# EAGLE design pumpShield (EAGLE 9.1.0)
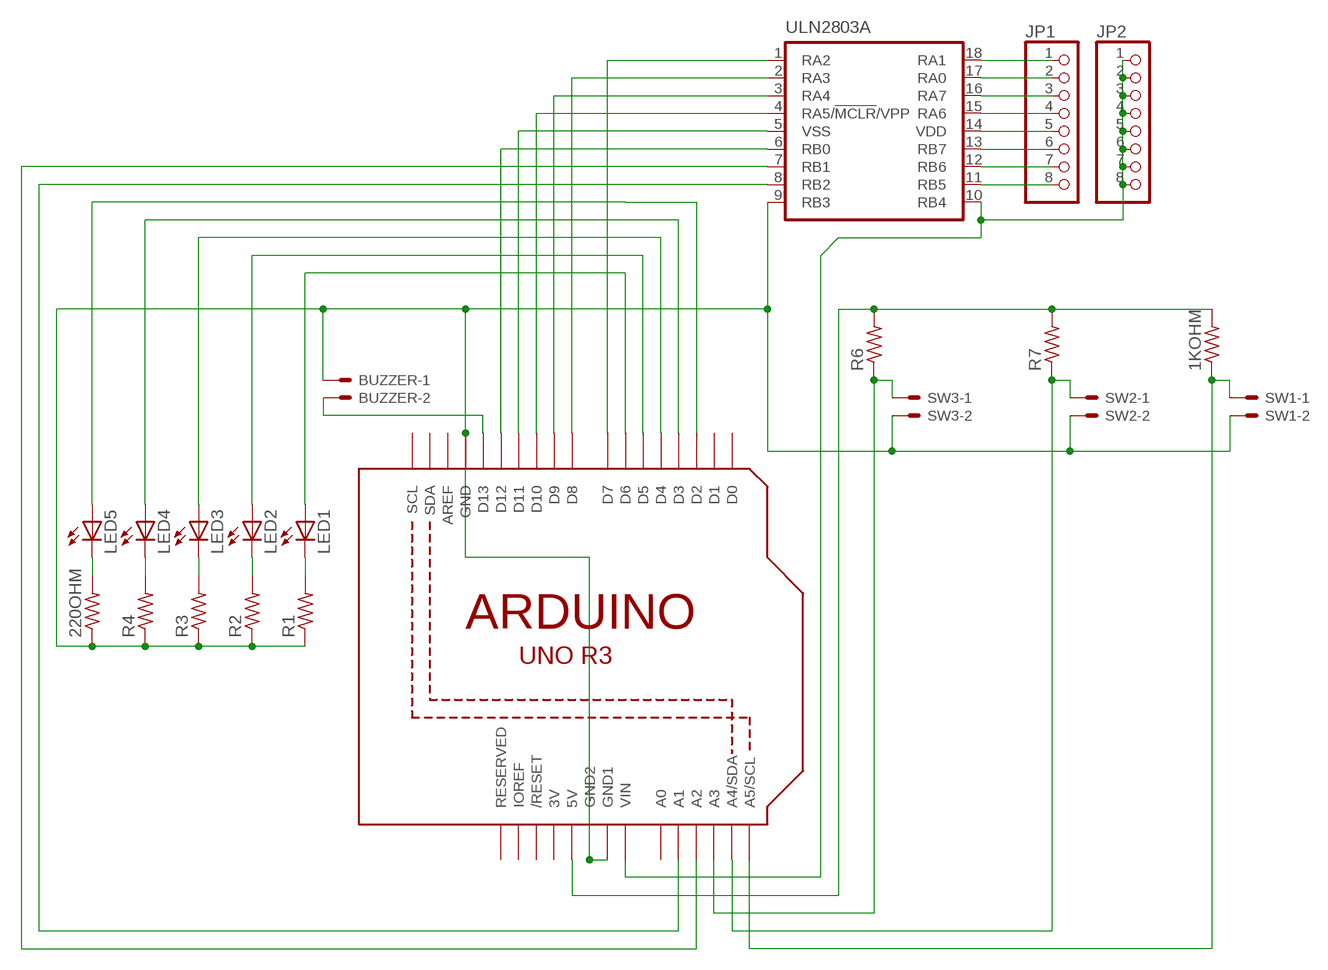
[diagram p0: schematic, sheet 1]

## Parts
1KOHM  R-US_0207/9  [0207/9]
220OHM  R-US_0207/9  [0207/9]
BUZZER  22-23-2021  [22-23-2021]
JP1  PINHD-1X8CLEANBIG  [1X08-CLEANBIG]
JP2  PINHD-1X8CLEANBIG  [1X08-CLEANBIG]
LED1  LED3MM  [LED3MM]
LED2  LED3MM  [LED3MM]
LED3  LED3MM  [LED3MM]
LED4  LED3MM  [LED3MM]
LED5  LED3MM  [LED3MM]
R1  R-US_0207/9  [0207/9]
R2  R-US_0207/9  [0207/9]
R3  R-US_0207/9  [0207/9]
R4  R-US_0207/9  [0207/9]
R6  R-US_0207/9  [0207/9]
R7  R-US_0207/9  [0207/9]
SW1  22-23-2021  [22-23-2021]
SW2  22-23-2021  [22-23-2021]
SW3  22-23-2021  [22-23-2021]
U1  ARDUINOR3-DIMENSION  [ARDUINOR3]
ULN2803A  PIC16F1826/27P  [DIL18]

## Nets
N$1: 220OHM.1 BUZZER.1 R1.1 R2.1 R3.1 R4.1 SW1.2 SW2.2 SW3.2 U1.GND U1.GND1 U1.GND2 ULN2803A.9(RB3)
N$2: JP2.1 JP2.2 JP2.3 JP2.4 JP2.5 JP2.6 JP2.7 JP2.8 U1.VIN ULN2803A.10(RB4)
N$3: LED1.A U1.D6
N$4: LED2.A U1.D5
N$5: LED3.A U1.D4
N$6: LED4.A U1.D3
N$7: U1.D7 ULN2803A.1(RA2)
N$8: U1.D8 ULN2803A.2(RA3)
N$9: U1.D9 ULN2803A.3(RA4)
N$10: U1.D10 ULN2803A.4(RA5/!MCLR!/VPP)
N$11: U1.D11 ULN2803A.5(VSS)
N$12: U1.D12 ULN2803A.6(RB0)
N$13: LED1.K(C) R1.2
N$14: LED2.K(C) R2.2
N$15: LED3.K(C) R3.2
N$16: LED4.K(C) R4.2
N$17: 220OHM.2 LED5.K(C)
N$18: LED5.A U1.D2
N$19: BUZZER.2 U1.D13
N$20: 1KOHM.2 R6.2 R7.2 U1.5V
N$21: JP1.8 ULN2803A.11(RB5)
N$22: JP1.7 ULN2803A.12(RB6)
N$23: JP1.6 ULN2803A.13(RB7)
N$24: JP1.5 ULN2803A.14(VDD)
N$25: JP1.4 ULN2803A.15(RA6)
N$26: JP1.3 ULN2803A.16(RA7)
N$27: R6.1 SW3.1 U1.A3
N$28: R7.1 SW2.1 U1.A4(A4/SDA)
N$29: 1KOHM.1 SW1.1 U1.A5(A5/SCL)
N$30: U1.A1 ULN2803A.8(RB2)
N$31: U1.A2 ULN2803A.7(RB1)
N$32: JP1.2 ULN2803A.17(RA0)
N$33: JP1.1 ULN2803A.18(RA1)
Unconnected: U1.A0 U1.AREF U1.D0 U1.D1 U1.IOREF U1.RESERVED U1.RESET(/RESET) U1.SCL U1.SDA

## Power pins joined to a net without a drawn wire
3V: U1.3V

## Library data of the parts
1KOHM 220OHM R1-R4 R6 R7 = adafruit:R-US_: RESISTOR, American symbol
BUZZER SW1-SW3 = con-molex:22-23-2021: .100" (2.54mm) Center Header - 2 Pin; MF: MOLEX; MPN: 22-23-2021; OC_FARNELL: 1462926; OC_NEWARK: 25C3832
JP1 JP2 = adafruit:PINHD-1X8: PIN HEADER
LED1-LED5 = adafruit:LED: LED OSRAM: - CHIPLED LG R971, LG N971, LY N971, LG Q971, LY Q971, LO R971, LY R971 LH N974, LH R974 LS Q976, LO Q976, LY Q976 LO Q996 - Hyper CHIPLED LW Q18S LB Q993, LB Q99A, LB R99A - SideLED LS A670, LO A670, LY A670, LG A670, LP A670 LB A673, LV A673, LT A673, LW A673 LH A674 LY A675 LS A676, LA A676, LO A676, LY A676, LW A676 LS A679, LY A679, LG A679 - Hyper Micro SIDELED® LS Y876, LA Y876, LO Y876, LY Y876 LT Y87S - SmartLED LW L88C, LW L88S LB L89C, LB L89S, LG L890 LS L89K, LO L89K, LY L89K LS L896, LA L896, LO L896, LY L896 - TOPLED LS T670, LO T670, LY T670, LG T670, LP T670 LSG T670, LSP T670, LSY T670, LOP T670, LYG T670 LG T671, LOG T671, LSG T671 LB T673, LV T673, LT T673, LW T673 LH T674 LS T676, LA T676, LO T676, LY T676, LB T676, LH T676, LSB T676, LW T676 LB T67C, LV T67C, LT T67C, LS T67K, LO T67K, LY T67K, LW E67C LS E67B, LA E67B, LO E67B, LY E67B, LB E67C, LV E67C, LT E67C LW T67C LS T679, LY T679, LG T679 LS T770, LO T770, LY T770, LG T770, LP T770 LB T773, LV T773, LT T773, LW T773 LH T774 LS E675, LA E675, LY E675, LS T675 LS T776, LA T776, LO T776, LY T776, LB T776 LHGB T686 LT T68C, LB T68C - Hyper Mini TOPLED® LB M676 - Mini TOPLED Santana® LG M470 LS M47K, LO M47K, LY M47K Source: http://www.osram.convergy.de/
U1 = adafruit:ARDUINOR3: This is a new object for the new Arduino R3 - with extra pins that you may want to use (such as IOref, and duplicated A4/A5
ULN2803A = microchip:PIC16*F1826/27: 18/20/28-Pin Flash Microcontrollers with nanoWatt XLP Technology Source: www.microchip.com PIC16F1827.pdf

## Board
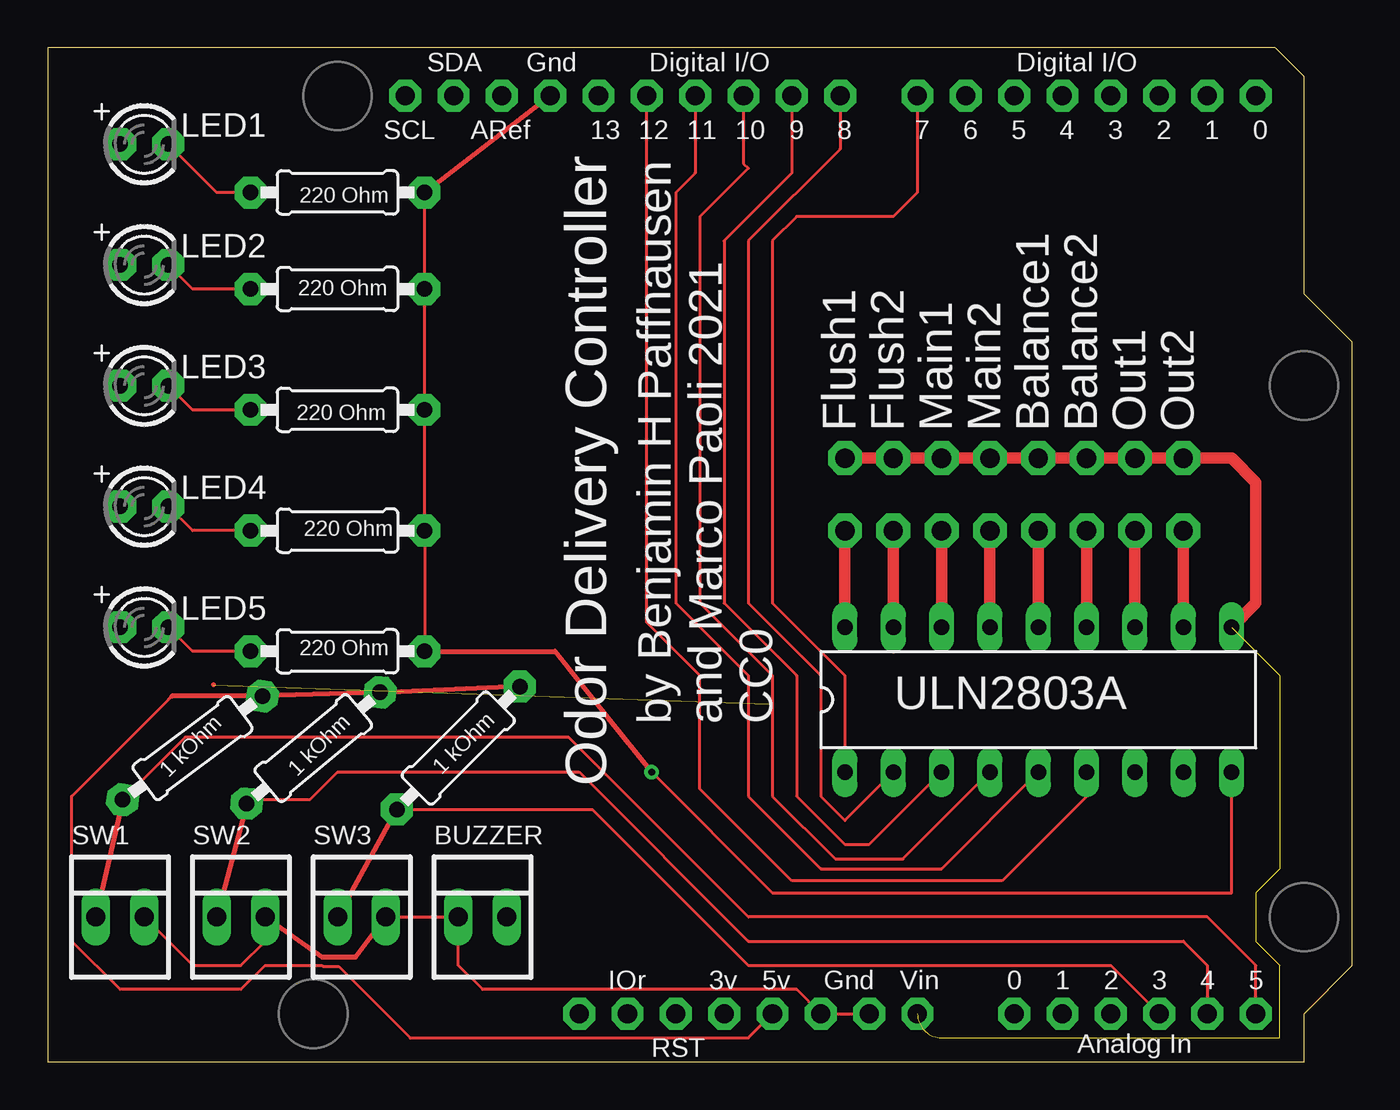
[diagram p1: board, top side]
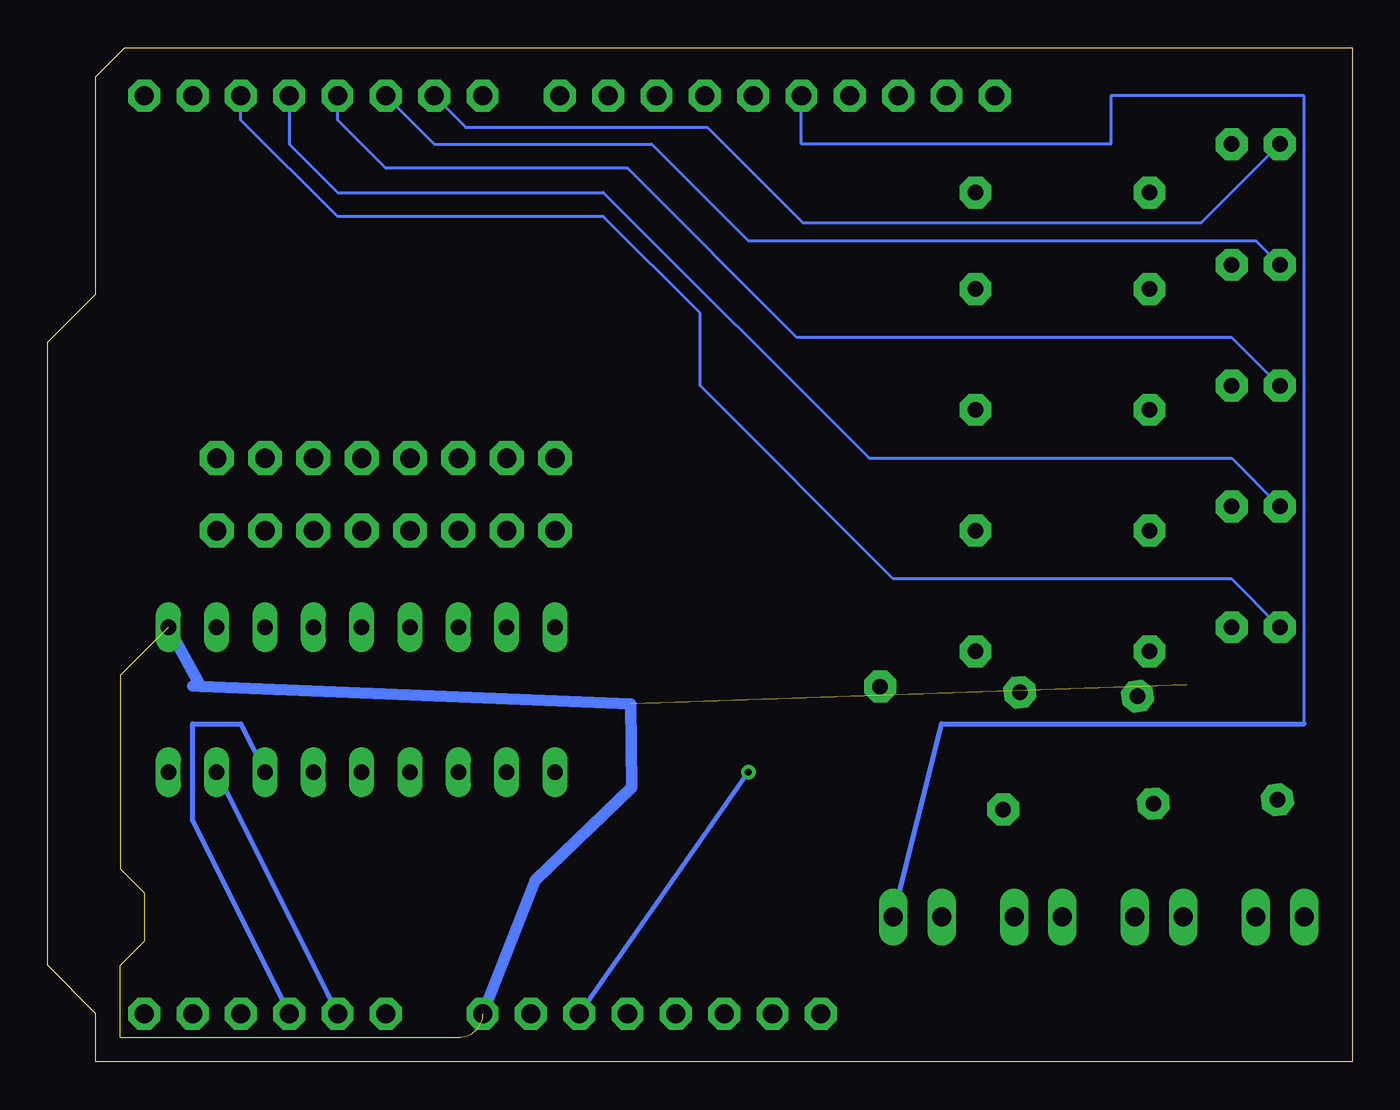
[diagram p2: board, bottom side, seen from below]

Size 68.58 x 53.34 mm. Coordinates in mm from the lower left corner, seen from the top.
Copper layers (1*16): Top 0.035mm / dielectric 1.5mm / Bottom 0.035mm
Design rules "default": minimum track width 6mil, minimum drill 0.35mm, track to track 6mil, track to pad 6mil, pad to pad 6mil, via to via 6mil, smd to smd 6mil, copper to edge 40mil, drill to drill 6mil, minimum pad ring 10mil, minimum via ring 8mil, stop-mask expansion 4mil, vias tented up to drill 0mil, thermal gap 10mil

### Footprints (pad centres in the part's own frame; a part is rotated, then mirrored left to right if it is on the bottom)
0207/9 = drill 0.813 pad 1.676 octagon: 1 -4.572,0; 2 4.572,0
22-23-2021 = drill 1 long: 1 -1.27,0; 2 1.27,0
1X08-CLEANBIG = drill 1.016 pad 1.778 octagon: 1 -8.89,0; 2 -6.35,0; 3 -3.81,0; 4 -1.27,0; 5 1.27,0; 6 3.81,0; 7 6.35,0; 8 8.89,0
LED3MM = drill 0.813 pad 1.676 octagon: A -1.27,0; K 1.27,0
ARDUINOR3 = drill 1 pad 1.676 octagon: 3V 35.56,2.54; 5V 38.1,2.54; A0 50.8,2.54; A1 53.34,2.54; A2 55.88,2.54; A3 58.42,2.54; A4 60.96,2.54; A5 63.5,2.54; AREF 23.876,50.8; D0 63.5,50.8; D1 60.96,50.8; D2 58.42,50.8; D3 55.88,50.8; D4 53.34,50.8; D5 50.8,50.8; D6 48.26,50.8; D7 45.72,50.8; D8 41.656,50.8; D9 39.116,50.8; D10 36.576,50.8; D11 34.036,50.8; D12 31.496,50.8; D13 28.956,50.8; GND 26.416,50.8; GND1 43.18,2.54; GND2 40.64,2.54; IOREF 30.48,2.54; RESERVED 27.94,2.54; RESET 33.02,2.54; SCL 18.796,50.8; SDA 21.336,50.8; VIN 45.72,2.54
DIL18 = drill 0.813 long: 1 -10.16,-3.81; 2 -7.62,-3.81; 3 -5.08,-3.81; 4 -2.54,-3.81; 5 0,-3.81; 6 2.54,-3.81; 7 5.08,-3.81; 8 7.62,-3.81; 9 10.16,-3.81; 10 10.16,3.81; 11 7.62,3.81; 12 5.08,3.81; 13 2.54,3.81; 14 0,3.81; 15 -2.54,3.81; 16 -5.08,3.81; 17 -7.62,3.81; 18 -10.16,3.81

### Placement (x,y rotation side)
1KOHM  7.62,16.51 36.6 top
220OHM  15.24,21.59 180 top
BUZZER  22.86,7.62 0 top
JP1  50.8,27.94 0 top
JP2  50.8,31.75 0 top
LED1  5.08,48.26 0 top
LED2  5.08,41.91 0 top
LED3  5.08,35.56 0 top
LED4  5.08,29.21 0 top
LED5  5.08,22.86 0 top
R1  15.24,45.72 180 top
R2  15.24,40.64 180 top
R3  15.24,34.29 180 top
R4  15.24,27.94 180 top
R6  21.59,16.51 45 top
R7  13.97,16.51 39.8 top
SW1  3.81,7.62 0 top
SW2  10.16,7.62 0 top
SW3  16.51,7.62 0 top
U1  0,0 0 top
ULN2803A  52.07,19.05 0 top

### Tracks (layer width: path | path; a pad name or v marks a point on that pad's centre or on a via)
N$1  (via drill 0.35)
  Top 0.152: SW1.2 7.62,5.08 10.16,5.08 11.43,6.35 SW2.2 | SW3.2 BUZZER.1 21.59,5.08 22.86,3.81 39.37,3.81 U1.GND2 U1.GND1 | 26.67,21.59 20.32,21.59 | 20.32,21.59 220OHM.1 | 20.32,21.59 19.81,22.1 R4.1 R3.1 R2.1 R1.1 | v31.75,15.24 38.1,8.89 62.23,8.89 ULN2803A.9
  Top 0.254: U1.GND R1.1 | 220OHM.1 26.67,21.59 29.47,18.09 v31.75,15.24 | SW2.2 14.41,5.52 16.19,5.52 SW3.2
  Bottom 0.254: v31.75,15.24 U1.GND2
N$2  (9 unrouted)
  Top 0.254: 8.71,19.84 | 8.71,19.84
  Top 0.61: ULN2803A.10 63.5,24.13 63.5,30.48 62.23,31.75 JP2.8 JP2.7 JP2.6 JP2.5 50.8,31.75 JP2.4 JP2.3 JP2.2 JP2.1
  Bottom 0.61: U1.VIN 42.95,9.55 37.87,14.43 37.92,18.82 60.53,19.74 | 60.53,19.74 60.96,19.76 | 60.53,19.74 ULN2803A.10
N$3
  Bottom 0.152: LED1.A 7.95,44.12 28.88,44.12 33.91,49.15 46.61,49.15 U1.D6
N$4
  Bottom 0.152: U1.D5 48.26,48.26 36.83,48.26 31.75,43.18 5.08,43.18 LED2.A
N$5
  Bottom 0.152: LED3.A 6.35,38.1 29.21,38.1 38.1,46.99 50.8,46.99 53.34,49.53 U1.D4
N$6
  Bottom 0.152: U1.D3 55.88,48.26 53.34,45.72 39.37,45.72 25.4,31.75 6.35,31.75 LED4.A
N$7
  Top 0.152: U1.D7 45.72,45.72 44.45,44.45 39.37,44.45 38.1,43.18 38.1,24.13 41.91,20.32 ULN2803A.1
N$8
  Top 0.152: U1.D8 41.66,48.01 36.83,43.18 36.83,24.13 40.64,20.32 40.64,13.97 41.91,12.7 ULN2803A.2
N$9
  Top 0.152: U1.D9 39.12,46.74 35.56,43.18 35.56,24.13 39.37,20.32 39.37,13.97 41.91,11.43 43.18,11.43 ULN2803A.3
N$10
  Top 0.152: U1.D10 36.58,47.24 36.83,46.99 34.29,44.45 34.29,24.13 38.1,20.32 38.1,13.97 41.4,10.67 44.96,10.67 ULN2803A.4
N$11
  Top 0.152: U1.D11 34.04,46.74 33.02,45.72 33.02,24.13 36.83,20.32 36.83,13.97 40.64,10.16 46.99,10.16 ULN2803A.5
N$12
  Top 0.152: U1.D12 31.5,23.11 34.29,20.32 34.29,14.35 39.12,9.53 50.17,9.53 54.61,13.97 ULN2803A.6
N$13
  Top 0.152: R1.2 8.89,45.72 LED1.K
N$14
  Top 0.152: R2.2 7.62,40.64 LED2.K
N$15
  Top 0.152: R3.2 7.62,34.29 LED3.K
N$16
  Top 0.152: R4.2 7.62,27.94 LED4.K
N$17
  Top 0.152: 220OHM.2 7.62,21.59 LED5.K
N$18
  Bottom 0.152: LED5.A 6.35,25.4 24.13,25.4 34.29,35.56 34.29,39.37 39.37,44.45 53.34,44.45 58.42,49.53 U1.D2
N$19
  Bottom 0.152: U1.D13 28.96,48.26 12.7,48.26 12.7,50.8 2.54,50.8 2.54,17.78
  Bottom 0.254: BUZZER.2 21.59,17.78 2.54,17.78
N$20
  Top 0.152: 24.52,19.44 R6.2 | U1.5V 36.83,1.27 19.05,1.27 15.29,5.03 14.48,5.03 14.43,5.08 11.43,5.08 10.16,3.81 3.81,3.81 1.27,6.35 1.27,13.97 6.35,19.05 6.54,19.24 | R7.2 17.44,19.39 17.28,19.24
  Top 0.254: R6.2 17.44,19.39 | R7.2 1KOHM.2 6.54,19.24
N$21
  Top 0.61: JP1.8 ULN2803A.11
N$22
  Top 0.61: JP1.7 ULN2803A.12
N$23
  Top 0.61: JP1.6 ULN2803A.13
N$24
  Top 0.61: JP1.5 ULN2803A.14
N$25
  Top 0.61: JP1.4 ULN2803A.15
N$26
  Top 0.61: JP1.3 ULN2803A.16
N$27
  Top 0.152: U1.A3 55.88,5.08 36.83,5.08 28.63,13.28 R6.1
  Top 0.254: R6.1 SW3.1
N$28
  Top 0.152: U1.A4 60.96,5.08 59.69,6.35 36.83,6.35 27.94,15.24 15.24,15.24 14.61,14.61 13.81,13.81 10.69,13.81 R7.1
  Top 0.254: R7.1 SW2.1
N$29
  Top 0.152: U1.A5 63.5,5.08 60.96,7.62 36.83,7.62 27.38,17.07 7.23,17.07 1KOHM.1
  Top 0.254: 1KOHM.1 SW1.1
N$30
  Bottom 0.254: U1.A1 ULN2803A.8
N$31
  Bottom 0.254: U1.A2 60.96,12.7 60.96,17.78 58.42,17.78 ULN2803A.7
N$32
  Top 0.254: ULN2803A.17 44.45,21.59
  Top 0.61: ULN2803A.17 JP1.2
N$33
  Top 0.61: JP1.1 ULN2803A.18

### Text on the board
tPlace: 220 Ohm | 220 Ohm | 220 Ohm | Flush1 | Flush2 | Main1 | Main2 | Balance1 | Balance2 | Out1 | Out2 | 220 Ohm | 220 Ohm | by Benjamin H Paffhausen / and Marco Paoli 2021 / CC0 | 1 kOhm | 1 kOhm | 1 kOhm | Odor Delivery Controller